# Altium schematic sheet Sheet1.SchDoc
size 863 x 558 mm; SheetNumber: 1; SheetTotal: 1
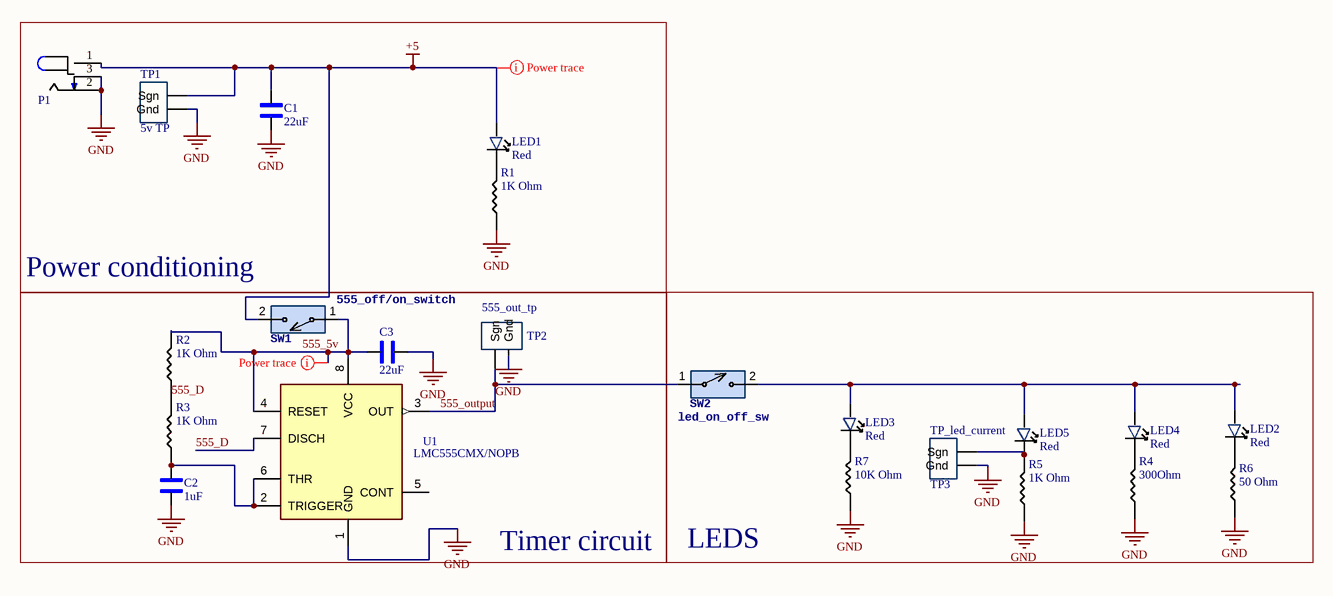
[diagram p0: Sheet1.SchDoc]

## Parts
C1  22uF  [1206_Passive_Capacitor]
C2  1uF  [1206_Passive_Capacitor]
C3  22uF  [1206_Passive_Capacitor]
LED1  Red  [LED_1206]
LED2  Red  [LED_1206]
LED3  Red  [LED_1206]
LED4  Red  [LED_1206]
LED5  Red  [LED_1206]
P1  Power Jack  [Power_Jack]  (value not drawn)
R1  value 1K Ohm  [1206_Passive_Resitor]  (hidden comment: 1k)
R2  value 1K Ohm  [1206_Passive_Resitor]  (hidden comment: 1k)
R3  value 1K Ohm  [1206_Passive_Resitor]  (hidden comment: 1k)
R4  value 300Ohm  [1206_Passive_Resitor]  (hidden comment: 300 Ohm)
R5  value 1K Ohm  [1206_Passive_Resitor]  (hidden comment: 1k)
R6  value 50 Ohm  [1206_Passive_Resitor]  (hidden comment: 100M)
R7  value 10K Ohm  [1206_Passive_Resitor]
SW1  555_off/on_switch  [2Pin-Header-Conn]
SW2  led_on_off_sw  [2Pin-Header-Conn]
TP1  5v TP  [TP10x_Probe]
TP2  555_out_tp  [TP10x_Probe]
TP3  TP_led_current  [TP10x_Probe]
U1  LMC555CMX/NOPB  [TS555IDTTR]

## Blocks framed on the sheet
Power conditioning: C1 LED1 P1 R1 TP1
Timer circuit: C2 C3 R2 R3 SW1 TP2 U1
LEDS: LED2-LED5 R4-R7 SW2 TP3

## Nets
+5: C1.2 LED1.1 P1.1 SW1.2 TP1.1(Sgn)
GND: C1.1 C2.1 C3.2 P1.2 P1.3 R1.1 R4.1 R5.1 R6.1 R7.1 TP1.2(Gnd) TP2.2(Gnd) TP3.2(Gnd) U1.1(GND)
555_5v: C3.1 R2.2 SW1.1 U1.4(RESET) U1.8(VCC)
555_D: R2.1 R3.2 U1.7(DISCH)
555_output: SW2.1 TP2.1(Sgn) U1.3(OUT)
NetC2_2: C2.2 R3.1 U1.2(TRIGGER) U1.6(THR)
NetLED1_2: LED1.2 R1.2
NetLED2_1: LED2.1 LED3.1 LED4.1 LED5.1 SW2.2
NetLED2_2: LED2.2 R6.2
NetLED3_2: LED3.2 R7.2
NetLED4_2: LED4.2 R4.2
NetLED5_2: LED5.2 R5.2 TP3.1(Sgn)

Not connected (* = marked no-connect by the designer): U1 5(CONT)

## Layout directives
rule Width Constraint [Pref Width = 20mil    Min Width = 10mil    Max Width = 100mil]: 555_5v, +5

## Notes on the sheet
- DWG. NO.
- REV.
- SHT.
- REVISION
- DESCRIPTION
- DATE
- APPROVED
- THIS DOCUMENT AND THE DATA DISCLOSED HEREIN OR HEREWITH IS THE PROPERTY OF ALTIUM LIMITED AND MAY BE FREELY DISTRIBUTED IN WHOLE. NO RIGHTS ARE RESERVED OR EXPRESS OR IMPLIED WARANTEE GIVEN.
- ENG:
- DSN:
- APPROVALS
- PROJECT
- DOCUMENT REVISION:
- DESIGN ITEM:
- CHK:
- BOM:
- REFERENCE DOCUMENTS
- PROJECT REVISION:
- TITLE
- FAB DWG:
- PCB DWG:
- ASSY DWG:
- SCALE:
- SIZE
- D
- CAGE CODE
- FILE NAME
- DWG NO.
- SHEET
- OF
- REV

## Library data of the parts
C1 C3 = C_22uF_1206: 22uF ±10% 25V X5R 1206 Multilayer Ceramic Capacitors MLCC - SMD/SMT RoHS; MFR Part #: CL31A226KAHNNNE; Type: basic; LCSC Part#: C12891; Datasheet: https://datasheet.lcsc.com/lcsc/1811031514_Samsung-Electro-Mechanics-CL31A226KAHNNNE_C12891.pdf; Value: 22uF
C2 = C_1uF_1206: MULTILAYER CERAMIC CAPACITORS MLCC - SMD/SMT 1UF 50V 1206 ROHS; MFR Part #: CL31B105KBHNNNE; Type: Basic; Digikey Link: https://www.digikey.com/product-detail/en/C1206C105M4RACTU/399-8150-1-ND/3471873/?itemSeq=304982366; LCSC Part#: C1848; Value: 1uF
LED1-LED5 = LED_RED_1206: Red 621~631nm 1206 Light Emitting Diodes (LED) RoHS; MFR Part #: 15-21/R6C-FQ1R1B/2T; Type: Extended; LCSC Part#: C93133; Datasheet: https://datasheet.lcsc.com/szlcsc/1811151241_Everlight-Elec-15-21-R6C-FQ1R1B-2T_C93133.pdf; Value: Red
P1 = P_Power Jack: Power Barrel Connector Jack 2.10mm ID (0.083"), 5.50mm OD (0.217") Through Hole, Right Angle; MFR Part #: PJ-102A; Value: CONN PWR JACK 2X5.5MM SOLDER; Digikey Link: https://www.digikey.com/product-detail/en/PJ-102A/CP-102A-ND/275425/?itemSeq=304982367; LCSC Part#: C136744; Type: Extended
R1-R3 R5 = R_1K_1206: CHIP RESISTOR - SURFACE MOUNT 1KOHMS ±1% 1/4W 1206 ROHS; MFR Part #: RNCP1206FTD1K00CT; Digikey Link: https://www.digikey.com/product-detail/en/RNCP1206FTD1K00/RNCP1206FTD1K00CT-ND/2240675/?itemSeq=304982373; LCSC Part#: C4410; Type: Basic
R4 = R_300Ohm_1206: CHIP RESISTOR - SURFACE MOUNT 300OHMS ±1% 1/4W 1206 ROHS; MFR Part #: 1206W4F3000T5E; Datasheet: https://datasheet.lcsc.com/szlcsc/Uniroyal-Elec-1206W4F3000T5E_C17887.pdf; LCSC Part#: C17887; Type: Basic
R6 R7 = R_100M_1206_1: CHIP RESISTOR - SURFACE MOUNT 100MOHMS ±1% 1/4W 1206 ROHS; MFR Part #: 1206W4F1006T5E; Digikey Link: https://www.digikey.com/en/products/detail/stackpole-electronics-inc/HMC1206JT100M/1742855; LCSC Part#: C59781; Type: Extended part
SW1 SW2 = SW_2Pin_100mil_Switch: 2Pin Header; LCSC Part#: C124375; Type: Extended
TP1-TP3 = TP_10x_Probe: Test Point 300 mil centers
U1 = U_555_Fast: 555 Type, Timer/Oscillator _Single_ IC 3MHz 8-SO; Package: SOIC-8; MFR Part #: LMC555CMX/NOPB; DigiKey link: https://www.digikey.com/product-detail/en/texas-instruments/LMC555CMX-NOPB/LMC555CMX-NOPBCT-ND/1010550; LCSC Part#: C90760; Type: Extended